# EAGLE schematic bblazeSeq (EAGLE 6.4)
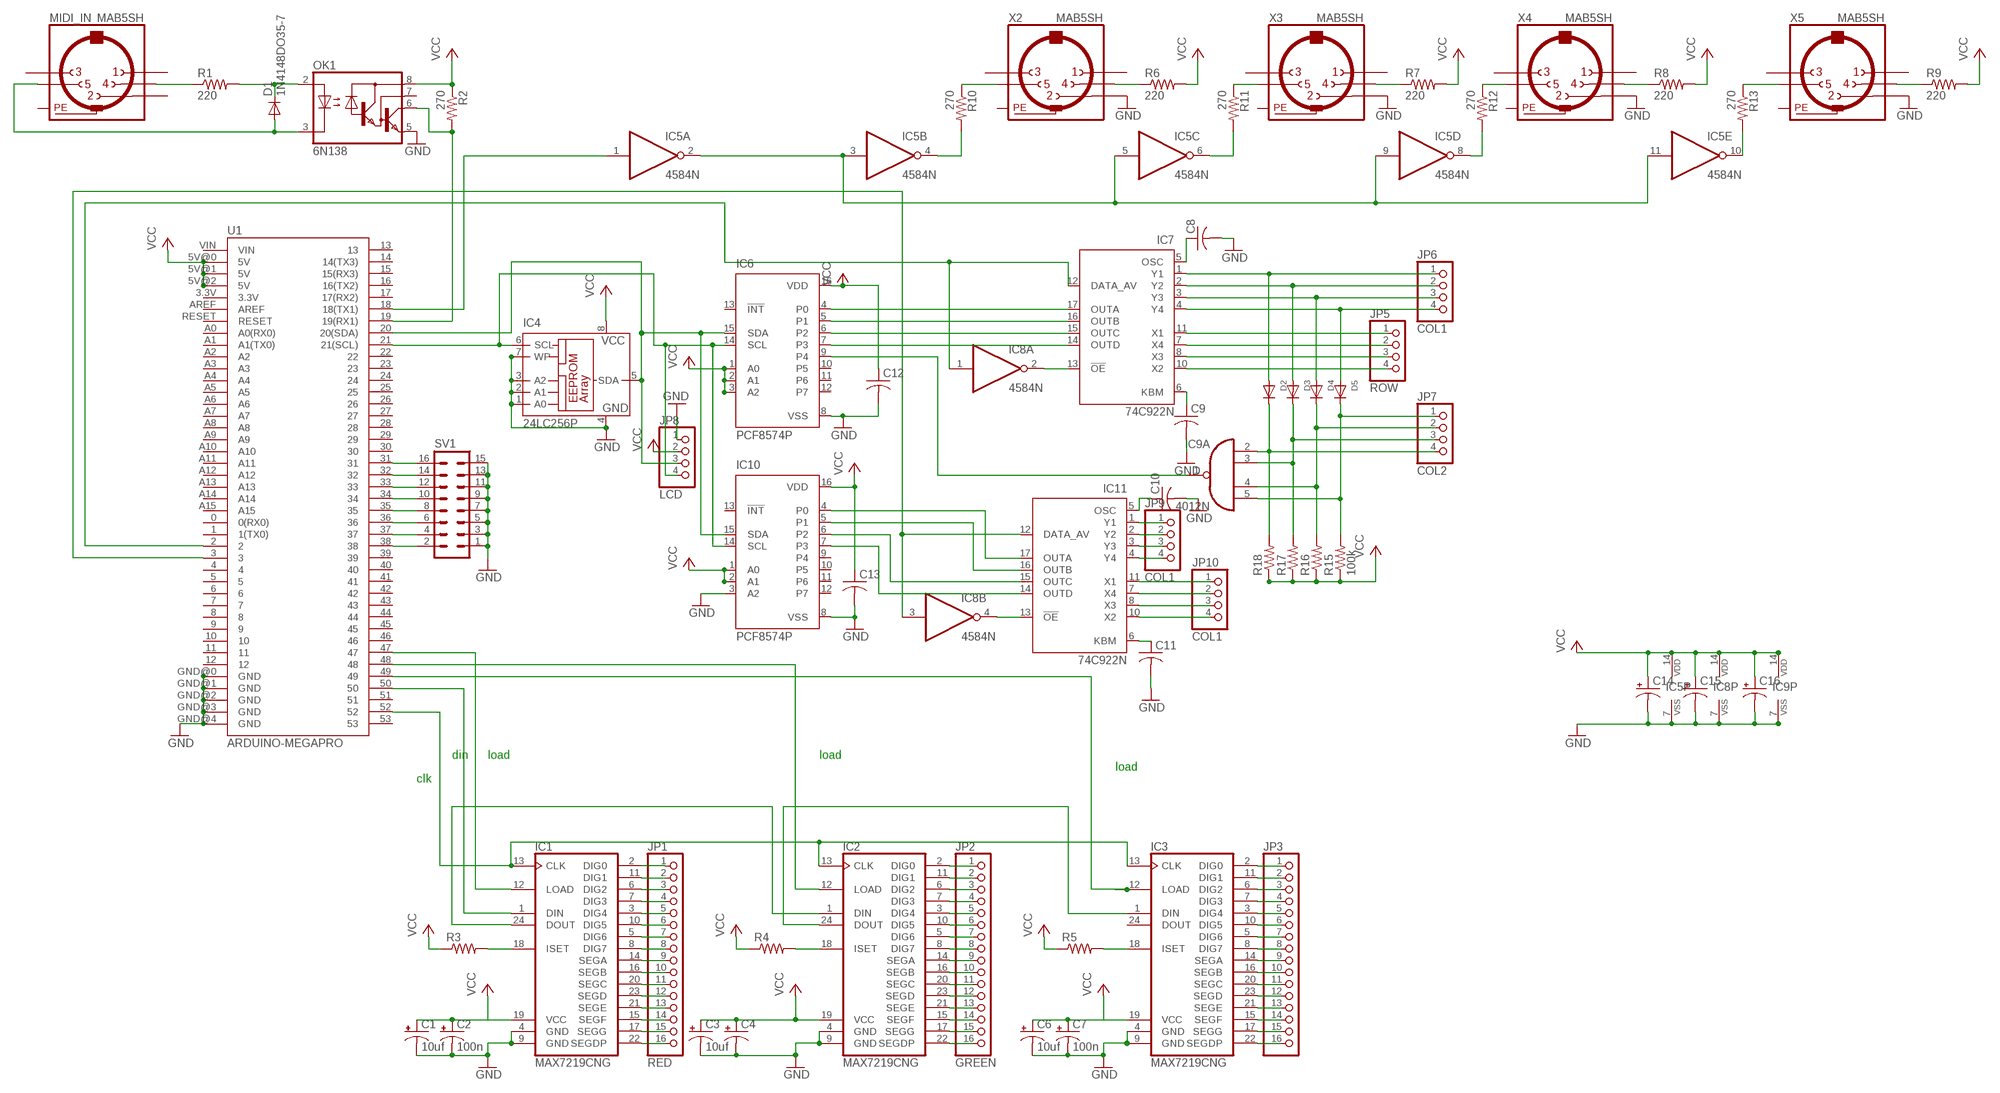
[diagram p0: schematic, sheet 1]

## Parts
C1  10uf  CPOL-USE2,5-6E  [E2,5-6E]
C2  100n  CPOL-USE2,5-6E  [E2,5-6E]
C3  10uf  CPOL-USE2,5-6E  [E2,5-6E]
C4  CPOL-USE2,5-6E  [E2,5-6E]
C6  10uf  CPOL-USE2,5-6E  [E2,5-6E]
C7  100n  CPOL-USE2,5-6E  [E2,5-6E]
C8  C-US050-024X044  [C050-024X044]
C9  C-US050-024X044  [C050-024X044]
C10  C-US050-024X044  [C050-024X044]
C11  C-US050-024X044  [C050-024X044]
C12  C-US050-024X044  [C050-024X044]
C13  C-US050-024X044  [C050-024X044]
C14  CPOL-USE2,5-6E  [E2,5-6E]
C15  CPOL-USE2,5-6E  [E2,5-6E]
C16  CPOL-USE2,5-6E  [E2,5-6E]
D1  1N4148DO35-7  [DO35-7]
D2  DIODEDO-1N4148  [DO-1N4148]
D3  DIODEDO-1N4148  [DO-1N4148]
D4  DIODEDO-1N4148  [DO-1N4148]
D5  DIODEDO-1N4148  [DO-1N4148]
IC1  MAX7219CNG  [DIL24-3]
IC2  MAX7219CNG  [DIL24-3]
IC3  MAX7219CNG  [DIL24-3]
IC4  24LC256P  [DIL8]
IC5  4584N  [DIL14]
IC6  PCF8574P  [DIL16]
IC7  74C922N  [DIL18]
IC8  4584N  [DIL14]
IC9  4012N  [DIL14]
IC10  PCF8574P  [DIL16]
IC11  74C922N  [DIL18]
JP1  RED  PINHD-1X16  [1X16]
JP2  GREEN  PINHD-1X16  [1X16]
JP3  PINHD-1X16  [1X16]
JP5  ROW  PINHD-1X4  [1X04]
JP6  COL1  PINHD-1X4  [1X04]
JP7  COL2  PINHD-1X4  [1X04]
JP8  LCD  PINHD-1X4  [1X04]
JP9  COL1  PINHD-1X4  [1X04]
JP10  COL1  PINHD-1X4  [1X04]
MIDI_IN  MAB5SH  [MAB5SH]
OK1  6N138  [DIL08]
R1  220  R-US_0207/10  [0207/10]
R2  270  R-US_0207/10  [0207/10]
R3  R-US_0204/7  [0204/7]
R4  R-US_0204/7  [0204/7]
R5  R-US_0204/7  [0204/7]
R6  220  R-US_0204/7  [0204/7]
R7  220  R-US_0204/7  [0204/7]
R8  220  R-US_0204/7  [0204/7]
R9  220  R-US_0204/7  [0204/7]
R10  270  R-US_0207/10  [0207/10]
R11  270  R-US_0207/10  [0207/10]
R12  270  R-US_0207/10  [0207/10]
R13  270  R-US_0207/10  [0207/10]
R15  100k  R-US_0204/7  [0204/7]
R16  R-US_0204/7  [0204/7]
R17  R-US_0204/7  [0204/7]
R18  R-US_0204/7  [0204/7]
SV1  MA08-2  [MA08-2]
U1  ARDUINO-MEGAPRO  [ARDUINO_MEGA-PRO-3.3V]
X2  MAB5SH  [MAB5SH]
X3  MAB5SH  [MAB5SH]
X4  MAB5SH  [MAB5SH]
X5  MAB5SH  [MAB5SH]

## Nets
GND: C1.- C2.- C3.- C4.- C6.- C7.- C8.2 C9.2 C10.2 C11.2 C12.2 C13.2 C14.- C15.- C16.- IC1.4(GND) IC1.9(GND) IC2.4(GND) IC2.9(GND) IC3.4(GND) IC3.9(GND) IC4.1(A0) IC4.2(A1) IC4.3(A2) IC4.4(GND) IC4.7(WP) IC5.7(P:VSS) IC6.8(VSS) IC8.7(P:VSS) IC9.7(P:VSS) IC10.3(A2) IC10.8(VSS) JP8.1 OK1.5(GND) SV1.1 SV1.3 SV1.5 SV1.7 SV1.9 SV1.11 SV1.13 SV1.15 U1.GND@0(GND) U1.GND@1(GND) U1.GND@2(GND) U1.GND@3(GND) U1.GND@4(GND) X2.2 X3.2 X4.2 X5.2
N$1: IC6.9(P4) IC9.1(A:O)
N$2: D2.C IC9.2(A:I0) JP7.4 R18.2
N$3: D3.C IC9.3(A:I1) JP7.3 R17.2
N$4: D4.C IC9.4(A:I2) JP7.2 R16.2
N$5: D5.C IC9.5(A:I3) JP7.1 R15.2
N$6: IC3.2(DIG0) JP3.1
N$7: IC3.11(DIG1) JP3.2
N$8: IC3.6(DIG2) JP3.3
N$9: IC3.7(DIG3) JP3.4
N$10: IC3.3(DIG4) JP3.5
N$11: IC3.10(DIG5) JP3.6
N$12: IC3.5(DIG6) JP3.7
N$13: IC3.8(DIG7) JP3.8
N$14: IC3.14(SEGA) JP3.9
N$15: D1.A MIDI_IN.5 OK1.3(C)
N$16: D1.C OK1.2(A) R1.2
N$17: MIDI_IN.4 R1.1
N$19: OK1.6(VO) R2.2 U1.19(19(RX1))
N$20: IC1.18(ISET) R3.2
N$21: IC4.6(SCL) IC6.14(SCL) IC10.14(SCL) JP8.4 U1.21(21(SCL))
N$22: IC4.5(SDA) IC6.15(SDA) IC10.15(SDA) JP8.3 U1.20(20(SDA))
N$23: IC2.18(ISET) R4.2
N$24: IC3.18(ISET) R5.2
N$25: IC3.12(LOAD) U1.49
N$26: IC2.12(LOAD) U1.48
N$28: C1.+ C2.+ IC1.19(VCC)
N$29: IC5.1(A:I) U1.18(18(TX1))
N$30: C6.+ C7.+ IC3.19(VCC)
N$31: IC2.24(DOUT) IC3.1(DIN)
N$32: IC1.24(DOUT) IC2.1(DIN)
N$33: IC1.13(CLK) IC2.13(CLK) IC3.13(CLK) U1.52
N$34: R6.1 X2.4
N$35: IC1.1(DIN) U1.50
N$36: IC1.12(LOAD) U1.47
N$37: R7.1 X3.4
N$38: R8.1 X4.4
N$39: R9.1 X5.4
N$40: R10.1 X2.5
N$41: R11.1 X3.5
N$42: R12.1 X4.5
N$43: R13.1 X5.5
N$44: IC5.4(B:O) R10.2
N$45: IC5.6(C:O) R11.2
N$46: IC5.8(D:O) R12.2
N$47: IC5.10(E:O) R13.2
N$48: IC5.2(A:O) IC5.3(B:I) IC5.5(C:I) IC5.9(D:I) IC5.11(E:I)
N$49: IC7.12(DATA_AV) IC8.1(A:I) U1.2
N$50: IC6.4(P0) IC7.17(OUTA)
N$51: IC6.5(P1) IC7.16(OUTB)
N$52: IC6.6(P2) IC7.15(OUTC)
N$53: IC6.7(P3) IC7.14(OUTD)
N$54: C9.1 IC7.6(KBM)
N$55: C8.1 IC7.5(OSC)
N$56: IC7.13(!OE) IC8.2(A:O)
N$57: IC7.11(X1) JP5.1
N$58: IC7.7(X4) JP5.2
N$59: IC7.8(X3) JP5.3
N$60: IC7.10(X2) JP5.4
N$61: D2.A IC7.1(Y1) JP6.1
N$62: D3.A IC7.2(Y2) JP6.2
N$63: D4.A IC7.3(Y3) JP6.3
N$64: D5.A IC7.4(Y4) JP6.4
N$65: IC3.16(SEGB) JP3.10
N$66: IC3.20(SEGC) JP3.11
N$67: IC3.23(SEGD) JP3.12
N$68: IC3.21(SEGE) JP3.13
N$69: IC3.15(SEGF) JP3.14
N$70: IC3.17(SEGG) JP3.15
N$71: IC3.22(SEGDP) JP3.16
N$72: IC1.2(DIG0) JP1.1
N$73: IC1.11(DIG1) JP1.2
N$74: IC1.6(DIG2) JP1.3
N$75: IC1.7(DIG3) JP1.4
N$76: IC1.3(DIG4) JP1.5
N$77: IC1.10(DIG5) JP1.6
N$78: IC1.5(DIG6) JP1.7
N$79: IC1.8(DIG7) JP1.8
N$80: IC1.14(SEGA) JP1.9
N$81: IC1.16(SEGB) JP1.10
N$82: IC1.20(SEGC) JP1.11
N$83: IC1.23(SEGD) JP1.12
N$84: IC1.21(SEGE) JP1.13
N$85: IC1.15(SEGF) JP1.14
N$86: IC1.17(SEGG) JP1.15
N$87: IC1.22(SEGDP) JP1.16
N$88: IC2.2(DIG0) JP2.1
N$89: IC2.11(DIG1) JP2.2
N$90: IC2.6(DIG2) JP2.3
N$91: IC2.7(DIG3) JP2.4
N$92: IC2.3(DIG4) JP2.5
N$93: IC2.10(DIG5) JP2.6
N$94: IC2.5(DIG6) JP2.7
N$95: IC2.8(DIG7) JP2.8
N$96: IC2.14(SEGA) JP2.9
N$97: IC2.16(SEGB) JP2.10
N$98: IC2.20(SEGC) JP2.11
N$99: IC2.23(SEGD) JP2.12
N$100: IC2.21(SEGE) JP2.13
N$101: IC2.15(SEGF) JP2.14
N$102: IC2.17(SEGG) JP2.15
N$103: IC2.22(SEGDP) JP2.16
N$104: IC8.4(B:O) IC11.13(!OE)
N$105: IC8.3(B:I) IC11.12(DATA_AV) U1.3
N$106: IC10.4(P0) IC11.17(OUTA)
N$107: IC10.5(P1) IC11.16(OUTB)
N$108: IC10.6(P2) IC11.15(OUTC)
N$109: IC10.7(P3) IC11.14(OUTD)
N$110: C10.1 IC11.5(OSC)
N$111: C11.1 IC11.6(KBM)
N$112: IC11.1(Y1) JP9.1
N$113: IC11.2(Y2) JP9.2
N$114: IC11.3(Y3) JP9.3
N$115: IC11.4(Y4) JP9.4
N$116: IC11.11(X1) JP10.1
N$117: IC11.7(X4) JP10.2
N$118: IC11.8(X3) JP10.3
N$119: IC11.10(X2) JP10.4
N$120: SV1.16 U1.31
N$121: SV1.14 U1.32
N$122: SV1.12 U1.33
N$123: SV1.10 U1.34
N$124: SV1.8 U1.35
N$125: SV1.6 U1.36
N$126: SV1.4 U1.37
N$127: SV1.2 U1.38
VCC: C3.+ C4.+ C12.1 C13.1 C14.+ C15.+ C16.+ IC2.19(VCC) IC4.8(VCC) IC5.14(P:VDD) IC6.1(A0) IC6.2(A1) IC6.3(A2) IC6.16(VDD) IC8.14(P:VDD) IC9.14(P:VDD) IC10.1(A0) IC10.2(A1) IC10.16(VDD) JP8.2 OK1.8(VCC) R2.1 R3.1 R4.1 R5.1 R6.2 R7.2 R8.2 R9.2 R15.1 R16.1 R17.1 R18.1 U1.5V@0(5V) U1.5V@1(5V) U1.5V@2(5V)
Unconnected: IC3.24(DOUT) IC5.12(F:O) IC5.13(F:I) IC6.10(P5) IC6.11(P6) IC6.12(P7) IC6.13(!INT) IC8.5(C:I) IC8.6(C:O) IC8.8(D:O) IC8.9(D:I) IC8.10(E:O) IC8.11(E:I) IC8.12(F:O) IC8.13(F:I) IC9.9(B:I0) IC9.10(B:I1) IC9.11(B:I2) IC9.12(B:I3) IC9.13(B:O) IC10.9(P4) IC10.10(P5) IC10.11(P6) IC10.12(P7) IC10.13(!INT) MIDI_IN.1 MIDI_IN.2 MIDI_IN.3 OK1.7(VB) U1.0(0(RX0)) U1.1(1(TX0)) U1.3.3V U1.4 U1.5 U1.6 U1.7 U1.8 U1.9 U1.10 U1.11 U1.12 U1.13 U1.14(14(TX3)) U1.15(15(RX3)) U1.16(16(TX2)) U1.17(17(RX2)) U1.22 U1.23 U1.24 U1.25 U1.26 U1.27 U1.28 U1.29 U1.30 U1.39 U1.40 U1.41 U1.42 U1.43 U1.44 U1.45 U1.46 U1.51 U1.53 U1.A0(A0(RX0)) U1.A1(A1(TX0)) U1.A2 U1.A3 U1.A4 U1.A5 U1.A6 U1.A7 U1.A8 U1.A9 U1.A10 U1.A11 U1.A12 U1.A13 U1.A14 U1.A15 U1.AREF U1.RESET U1.VIN X2.1 X2.3 X3.1 X3.3 X4.1 X4.3 X5.1 X5.3

## Notes on the sheet
- din | load | load
- load
- clk

## Power pins joined to a net without a drawn wire
GND: IC7.9(GND) IC11.9(GND)
PE: MIDI_IN.PE MIDI_IN.PE@(PE) X2.PE X2.PE@(PE) X3.PE X3.PE@(PE) X4.PE X4.PE@(PE) X5.PE X5.PE@(PE)
VCC: IC7.18(VCC) IC11.18(VCC)

## Library data of the parts
C1-C4 C6 C7 C14-C16 = rcl:CPOL-US: POLARIZED CAPACITOR, American symbol
C8-C13 = resistor:C-US: CAPACITOR, American symbol
D1 = diode:1N4148: DIODE high speed (Philips)
D2-D5 = adafruit:DIODE: Diode SMADIODE - SMA Surface Mount Package 20V 1A Schottky Diode Digikey: 641-1014-6-ND DO-1N4148 - Through Hole Small Current Diode SOD-123 20V 1 A (.5mV Vf) Schottky Diode - Digikey: MBRX120TPMSCT-ND SOD-323 10V 570mA (.38mV Vf, 3ns) Schottky Diode - Digikey: ZLLS410CT-ND SOD-523 30V 30mA Schottky Diode (RB751S-40TE61) - Digikey: RB751S-40TE61CT-ND SOT23-R/W - SOT23 Package (R = Solder Paste/Reflow Ovens, W = Hand-Soldering) BAT54Film 40V 300mA - Digikey: 497-7162-1-ND
IC1-IC3 = maxim:MAX7219CNG: LED DISPLAY DRIVER; MF: MAXIM; MPN: MAX7219CNG; OC_FARNELL: 1523914; OC_NEWARK: 34C4018
IC4 = microchip:24*: Serial EEPROM I2C; MF: MICROCHIP; MPN: 24LC256-E/P; OC_FARNELL: 9757970; OC_NEWARK: 92C7169
IC5 IC8 = 45xx:4584: Hex SCHMITT TRIGGER (74C14)
IC6 IC10 = micro-philips:PCF8574: I2C-Bus Remote 8-bit I/O expander http://www.semiconductors.philips.com/acrobat_download/datasheets/PCF8574_4.pdf; MPN: PCF8574PN; OC_FARNELL: 204020; OC_NEWARK: 11N8515
IC7 IC11 = 74xx-us:74C922: 16-Key Encoder Source: http://www.national.com/ds/MM/MM54C922.pdf#page=1
IC9 = 40xx:4012: Dual 4-input NAND
JP1-JP3 = pinhead:PINHD-1X16: PIN HEADER
JP5-JP10 = pinhead:PINHD-1X4: PIN HEADER
MIDI_IN X2-X5 = con-hirschmann:MAB5SH: Female CONNECTOR 5 pins 90 deg. with shield, horizontal (DIN 41524); OC_FARNELL: 809883; OC_NEWARK: unknown
OK1 = optocoupler:6N138: MOTOROLA OPTO COUPLER; MF: VISHAY/TELEFUNKEN; MPN: 6N138; OC_FARNELL: 9860150; OC_NEWARK: 35K5294
R1 R2 R10-R13 = rcl:R-US_: RESISTOR, American symbol
R3-R9 R15-R18 = resistor:R-US_: RESISTOR, American symbol
SV1 = con-lstb:MA08-2: PIN HEADER; OC_FARNELL: unknown; OC_NEWARK: unknown
U1 = SparkFun-Boards:ARDUINO-MEGA: Arduino Mega board footprint